# EAGLE design UV_MONITOR_V2_5 (EAGLE 8.4.2)
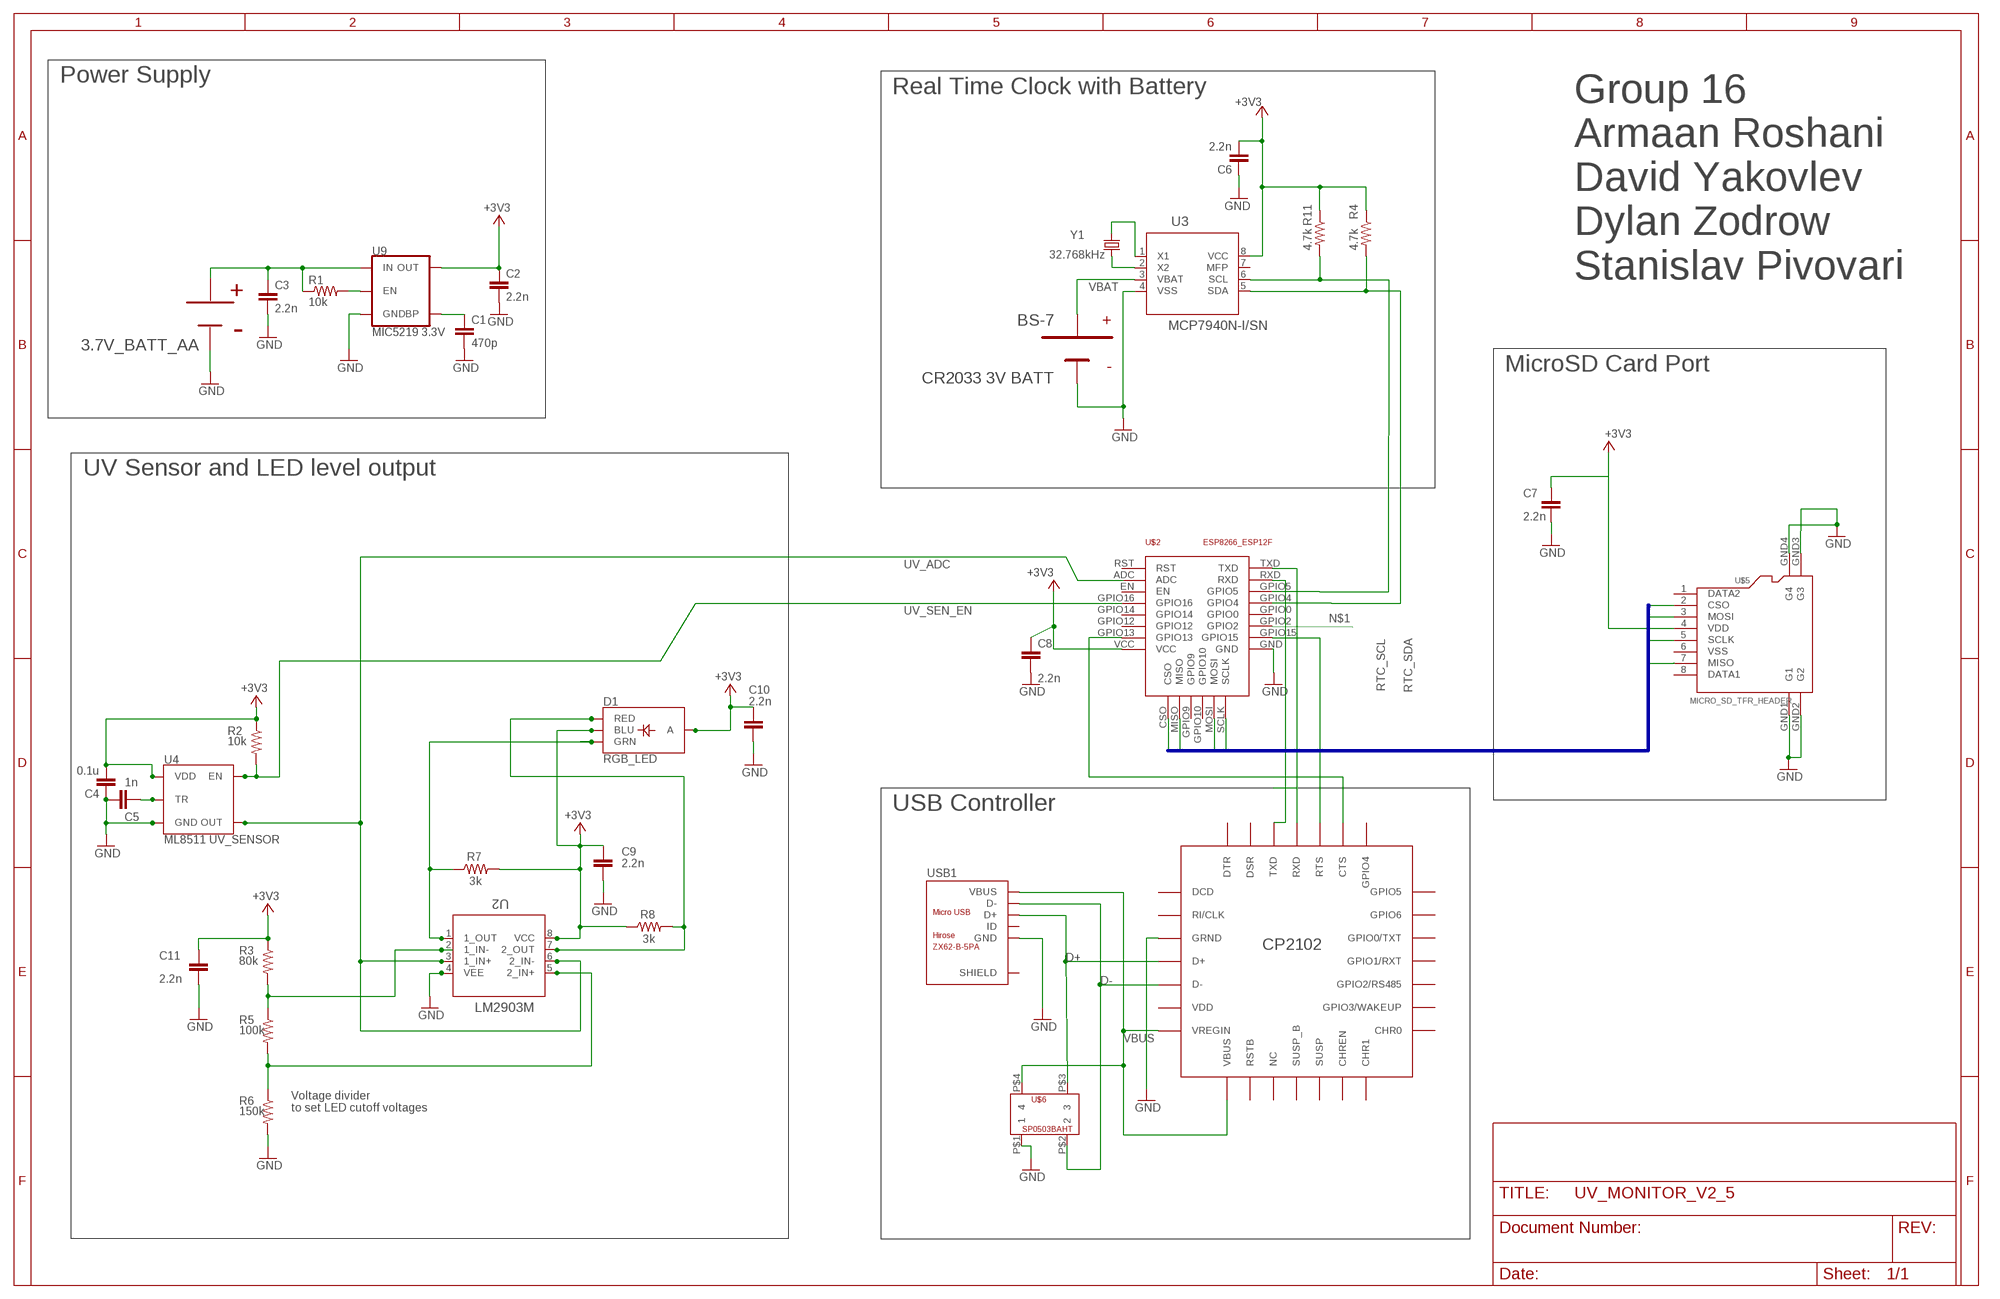
[diagram p0: schematic, sheet 1]

## Parts
C1  470p  C-EUC0805  [C0805]
C2  2.2n  C-EUC0805  [C0805]
C3  2.2n  C-EUC0805  [C0805]
C4  0.1u  C-EUC0805  [C0805]
C5  1n  C-EUC0805  [C0805]
C6  2.2n  C-EUC0805  [C0805]
C7  2.2n  C-EUC0805  [C0805]
C8  2.2n  C-EUC0805  [C0805]
C9  2.2n  C-EUC0805  [C0805]
C10  2.2n  C-EUC0805  [C0805]
C11  2.2n  C-EUC0805  [C0805]
D1  RGB_LED  LED-RGB-CASMD  [LED-TRICOLOR-SMD]
R1  10k  R-US_R0805  [R0805]
R2  10k  R-US_R0805  [R0805]
R3  80k  R-US_R0805  [R0805]
R4  4.7k  R-US_R0805  [R0805]
R5  100k  R-US_R0805  [R0805]
R6  150k  R-US_R0805  [R0805]
R7  3k  R-US_R0805  [R0805]
R8  3k  R-US_R0805  [R0805]
R11  4.7k  R-US_R0805  [R0805]
U2  LM2903M  [M08A]
U3  MCP7940N-I/SN  [SOIC8-N_MC]
U4  ML8511 UV_SENSOR  ML8511  [ML8511]
U9  MIC5219 3.3V  V_REG_MIC52193.3V  [SOT23-5]
U$1  CP2102  [CP2102]
U$2  ESP12F  [ESP12F]
U$3  BK-53  [BK-53]
U$4  BS-7  [BS-7]
U$5  MICRO_SD_TFR_HEADER  [MICRO_SD_TFR_HEADER]
U$6  SP0503BAHT  [SP0503BAHT]
USB1  ZX62-B-5PA  MICRO-USB-SMD(ZX62-B-5PA)  [MICRO-USB5+6P-SMD-0.65-AB]
Y1  32.768kHz  CRYSTAL-32.768KHZSMD-2X6  [CRYSTAL-SMD-2X6-CYL]

## Nets
+3V3: C2.1 C4.2 C6.2 C7.1 C8.1 C9.1 C10.1 C11.1 D1.A D1.B(BLU) R2.1 R3.1 R4.1 R7.2 R8.1 R11.1 U2.8(VCC) U3.8(VCC) U4.7(VDD) U9.5(OUT) U$2.VCC
BP: C1.1 U9.4(BP)
CTS: U$1.CTS U$2.GPIO13
D+: U$1.D+ U$6.P$3 USB1.3(D+)
D-: U$1.D- U$6.P$2 USB1.2(D-)
EN: R1.2 U9.3(EN)
GND: C1.2 C2.2 C3.2 C4.1 C5.2 C6.1 C7.2 C8.2 C9.2 C10.2 C11.2 R6.2 U2.4(VEE) U3.4(VSS) U4.5(GND) U9.2(GND) U$1.GND(GRND) U$1.GRND U$2.GND U$3.GND1 U$3.GND2 U$4.GND U$5.GND1(G1) U$5.GND2(G2) U$5.GND3(G3) U$5.GND4(G4) U$6.P$1 USB1.5(GND)
GREEN_LED: D1.G(GRN) R7.1 U2.1(1_OUT)
H_REF: R3.2 R5.1 U2.2(1_IN-)
L_REF: R5.2 R6.1 U2.5(2_IN+)
MAIN_BAT: C3.1 R1.1 U9.1(IN) U$3.VBAT1(VBAT) U$3.VBAT2(VBAT)
N$1: U$2.GPIO2
N$2: U3.2(X2) Y1.X1
N$3: U$2.SCLK U$5.5(SCLK)
N$4: U$2.MOSI U$5.3(MOSI)
N$5: U$2.MISO U$5.7(MISO)
N$6: U3.1(X1) Y1.X2
N$7: U$2.CSO U$5.2(CSO)
N$8: U$5.4(VDD)
N$9: U$1.RXD U$2.TXD
N$10: U$1.TXD U$2.RXD
RED_LED: D1.R(RED) R8.2 U2.7(2_OUT)
RTC_SCL: R11.2 U3.6(SCL) U$2.GPIO5
RTC_SDA: R4.2 U3.5(SDA) U$2.GPIO4
RTS: U$1.RTS U$2.GPIO15
TR: C5.1 U4.10(TR)
UV_ADC: U2.3(1_IN+) U2.6(2_IN-) U4.8(OUT) U$2.ADC
UV_SEN_EN: R2.2 U4.4(EN) U$2.GPIO16
VBAT: U3.3(VBAT) U$4.VBAT
VBUS: U$1.VBUS U$1.VREGIN U$6.P$4 USB1.1(VBUS)
Unconnected: U3.7(MFP) U$1.CHR0 U$1.CHR1 U$1.CHREN U$1.DCD U$1.DSR U$1.DTR U$1.GPIO0/TXT U$1.GPIO1/RXT U$1.GPIO2/RS485 U$1.GPIO3/WAKEUP U$1.GPIO4 U$1.GPIO5 U$1.GPIO6 U$1.NC U$1.RI/CLK U$1.RSTB U$1.SUSP U$1.SUSPB(SUSP_B) U$1.VDD U$2.EN U$2.GPIO0 U$2.GPIO9 U$2.GPIO10 U$2.GPIO12 U$2.GPIO14 U$2.RST U$5.1(DATA2) U$5.6(VSS) U$5.8(DATA1) USB1.4(ID) USB1.P1(SHIELD) USB1.P2(SHIELD) USB1.P3(SHIELD) USB1.P4(SHIELD) USB1.P5(SHIELD) USB1.P6(SHIELD)

## Buses
B$1

## Notes on the sheet
- Power Supply
- Real Time Clock with Battery
- Group 16
  Armaan Roshani
  David Yakovlev
  Dylan Zodrow
  Stanislav Pivovari
- MicroSD Card Port
- UV Sensor and LED level output
- USB Controller
- Voltage divider
  to set LED cutoff voltages

## Library data of the parts
C1-C11 = rcl:C-EU: CAPACITOR, European symbol; SPICEPREFIX: C
D1 = SparkFun-LED:LED-RGB-CA: LED-RGB Diffused Common Anode Packages: LED RGB-THRU P-LCC-4-3 LED-TRICOLOR-SMD SparkFun Products: RGB Diffused Common Anode- Diffuse <[https://www.sparkfun.com/products/10821]> RGB Diffused Common Anode - Clear <[https://www.sparkfun.com/products/10820]> Qduino Mini <[https://www.sparkfun.com/products/13614]> Triple Output LED RGB - SMD <https://www.sparkfun.com/products/7844>; PROD_ID: DIO-08324
R1-R8 R11 = rcl:R-US_: RESISTOR, American symbol; SPICEPREFIX: R
U2 = LM2903M:LM2903M; MANUFACTURER_PART_NUMBER: LM2903M; VENDOR: Texas Instruments
U3 = MCP7940N:MCP7940N-I/SN; MANUFACTURER_PART_NUMBER: MCP7940NISN; VENDOR: MICROCHIP
U4 = SparkFun-Sensors:ML8511: Lapis ML8511 Ultraviolet Sensor The MP8511 UV (ultraviolet) Sensor works by outputing an analog signal in relation to the amount of UV light that’s detected. This sensor detects 280-390nm light most effectively. This is categorized as part of the UVB (burning rays) spectrum and most of the UVA (tanning rays) spectrum. It outputs a analog voltage that is linearly related to the measured UV intensity (mW/cm2). Datasheet <https://cdn.sparkfun.com/datasheets/Sensors/LightImaging/ML8511_3-8-13.pdf> SparkFun Products SparkFun UV Sensor Breakout - ML8511 <https://www.sparkfun.com/products/12705> (SEN-12705); PROD_ID: IC-11927
U9 = SparkFun-IC-Power:V_REG_MIC5219: V_REG MIC5219 Standard 3.3V and 5V 500mA LDO voltage regulator in SOT-23 layout. Micrel part MIC5219. BP (by-pass) pin is used to lower output noise with 470pF cap, may be left open.; PROD_ID: VREG-09872
U$1 = CP2102:CP2102
U$2 = ESP8266-ESP12F:ESP12F
U$3 = BK-53:BK-53
U$4 = BS-7:BS-7
U$5 = MicroSD TFR Header:MICRO_SD_TFR_HEADER
U$6 = SP0503BAHT:SP0503BAHT
USB1 = Seeed-Connector:MICRO-USB-SMD(ZX62-B-5PA): 320010005; MPN: ZX62-B-5PA
Y1 = SparkFun-Clocks:CRYSTAL-32.768KHZ: 32.768kHz Crystal Frequency: 32.768kHz Frequency Stability: ±20ppm Load Capacitance: 12.5pF (PTH-2X6 & SMD-3.2X1.5), 6pF (SMD-2X6) SparkFun Products: SparkFun BigTime Watch Kit <https://www.sparkfun.com/products/11734> SparkFun nRF52832 Breakout <https://www.sparkfun.com/products/13990> SparkFun Real Time Clock Module <https://www.sparkfun.com/products/12708>; PROD_ID: XTAL-07894

## Net classes
0 default: clearance 0.205 mm

## Board
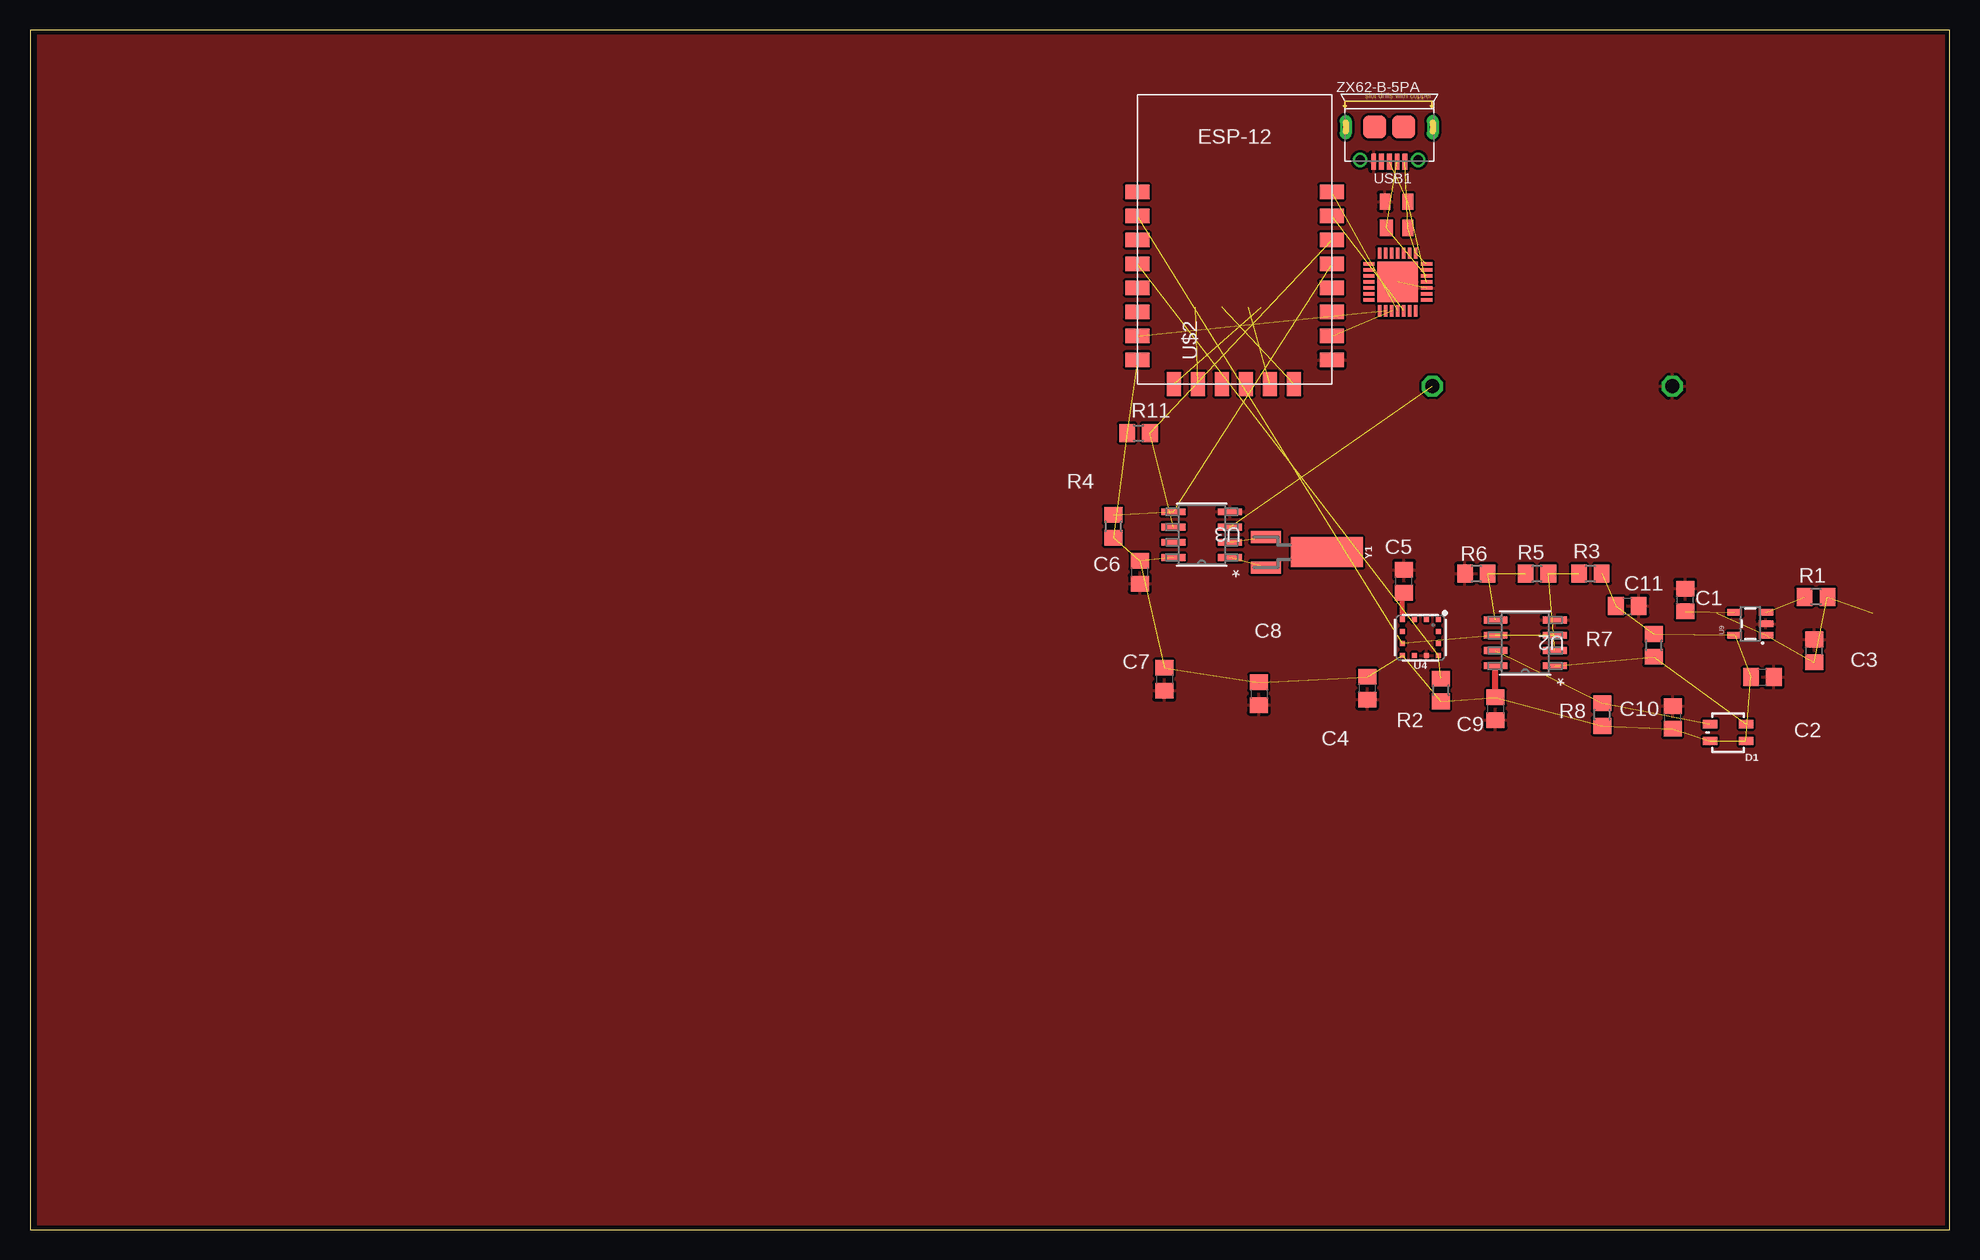
[diagram p1: board, top side]
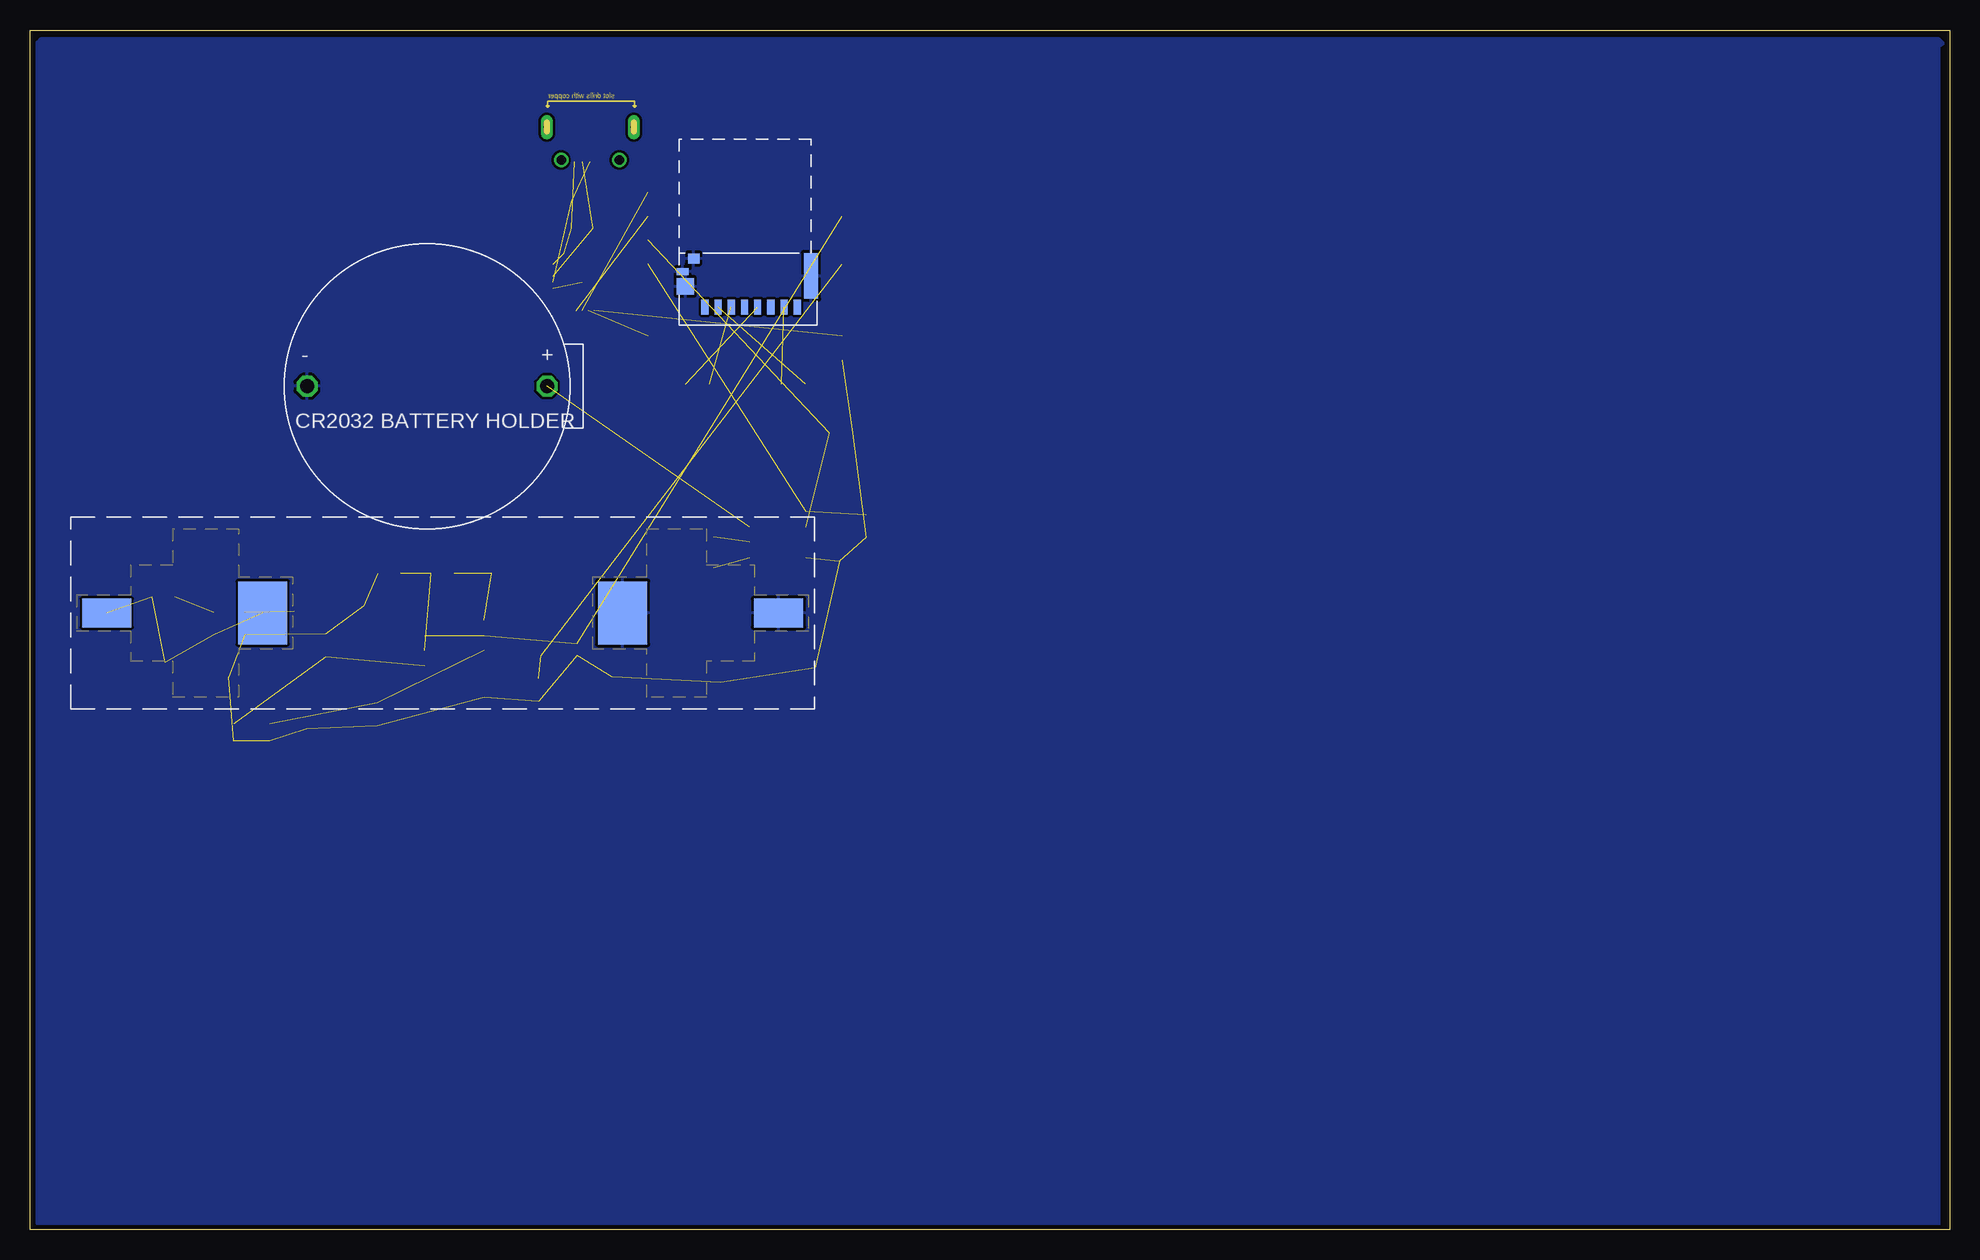
[diagram p2: board, bottom side, seen from below]

Size 160 x 100 mm. Coordinates in mm from the lower left corner, seen from the top.
Outline: 0,0 160,0 160,100 0,100 0,0
Copper layers (1*16): Top 0.0356mm / dielectric 1.5011mm / Bottom 0.0356mm
Design rules "osh-park-2-layers-design-rules": minimum track width 6mil, minimum drill 10mil, track to track 6mil, track to pad 6mil, pad to pad 6mil, via to via 6mil, smd to smd 6mil, copper to edge 15mil, drill to drill 6mil, minimum pad ring 7mil, minimum via ring 7mil, stop-mask expansion 3mil, vias tented up to drill 0mil, thermal gap 10mil

### Footprints (pad centres in the part's own frame; a part is rotated, then mirrored left to right if it is on the bottom)
C0805 = smd 1.3 x 1.5: 1 -0.95,0; 2 0.95,0
LED-TRICOLOR-SMD = smd 1.2 x 0.7: A 1.5,0.7; B -1.5,0.7; G -1.5,-0.7; R 1.5,-0.7
R0805 = smd 1.3 x 1.5: 1 -0.95,0; 2 0.95,0
M08A = smd 1.981 x 0.559: 1 -2.464,1.905; 2 -2.464,0.635; 3 -2.464,-0.635; 4 -2.464,-1.905; 5 2.464,-1.905; 6 2.464,-0.635; 7 2.464,0.635; 8 2.464,1.905
SOIC8-N_MC = smd 1.981 x 0.559: 1 -2.362,1.905; 2 -2.362,0.635; 3 -2.362,-0.635; 4 -2.362,-1.905; 5 2.362,-1.905; 6 2.362,-0.635; 7 2.362,0.635; 8 2.362,1.905
ML8511 = smd 0.4 x 0.4: 1 -1.5,-1.5; 2 -1.5,-0.5; 3 -1.5,0.5; 4 -1.5,1.5; 5 -0.5,1.5; 6 0.5,1.5; 7 1.5,1.5; 8 1.5,0.5; 9 1.5,-0.5; 10 1.5,-1.5; 11 0.5,-1.5; 12 -0.5,-1.5
SOT23-5 = smd 0.55 x 1.2: 1 -0.95,-1.3; 2 0,-1.3; 3 0.95,-1.3; 4 0.95,1.3; 5 -0.95,1.3
CP2102 = smd 0.95 x 0.3: CHR0 2.4,-1.5; D+ -2.4,0; D- -2.4,-0.5; DCD -2.4,1.5; GPIO0/TXT 2.4,0.5; GPIO1/RXT 2.4,0; GPIO2/RS485 2.4,-0.5; GPIO3/WAKEUP 2.4,-1; GPIO5 2.4,1.5; GPIO6 2.4,1; GRND -2.4,0.5; RI/CLK -2.4,1; VDD -2.4,-1; VREGIN -2.4,-1.5 | smd 0.3 x 0.95: CHR1 1.5,-2.4; CHREN 1,-2.4; CTS 1,2.4; DSR -1,2.4; DTR -1.5,2.4; GPIO4 1.5,2.4; NC -0.5,-2.4; RSTB -1,-2.4; RTS 0.5,2.4; RXD 0,2.4; SUSP 0.5,-2.4; SUSPB 0,-2.4; TXD -0.5,2.4; VBUS -1.5,-2.4 | smd 3.35 x 3.35: GND 0,0
ESP12F = smd 2 x 1.2: ADC 0,14; EN 0,12; GND 16.2,2; GPIO0 16.2,8; GPIO2 16.2,6; GPIO4 16.2,10; GPIO5 16.2,12; GPIO12 0,6; GPIO13 0,4; GPIO14 0,8; GPIO15 16.2,4; GPIO16 0,10; RST 0,16; RXD 16.2,14; TXD 16.2,16; VCC 0,2 | smd 1.2 x 2: CSO 3.05,0; GPIO9 7.05,0; GPIO10 9.05,0; MISO 5.05,0; MOSI 11.05,0; SCLK 13.05,0
BK-53 = smd 5.25 x 4.1: GND1 0,-15; VBAT1 0,15 | smd 2.4 x 4.1: GND2 0,-28; VBAT2 0,28
BS-7 = drill 1.17 octagon: GND -10,0; VBAT 10,0
MICRO_SD_TFR_HEADER = smd 0.6 x 1.25: 1 3.85,2; 2 2.75,2; 3 1.65,2; 4 0.55,2; 5 -0.55,2; 6 -1.65,2; 7 -2.75,2; 8 -3.85,2 | smd 1.2 x 3.8: GND1 -5,-0.6 | smd 1.45 x 1.4: GND2 5.475,0.275 | smd 1 x 0.6: GND3 5.7,-0.95 | smd 0.95 x 0.85: GND4 4.775,-2.05
SP0503BAHT = smd 0.9 x 1.35: P$1 -0.95,1.1; P$3 0.95,1.1; P$4 0.95,-1.1 | smd 1.1 x 1.35: P$2 -0.85,-1.1
MICRO-USB5+6P-SMD-0.65-AB = smd 0.4 x 1.35: 1 -1.3,2.875; 2 -0.65,2.875; 3 0,2.875; 4 0.65,2.875; 5 1.3,2.875 | smd 1.9 x 1.9: P1 -1.2,0; P2 1.2,0 | drill 0.508 pad 1.016 long: P3 -3.625,0; P4 3.625,0 | drill 0.8: P5 -2.425,2.73; P6 2.425,2.73
CRYSTAL-SMD-2X6-CYL = smd 2.5 x 6: SHEILD 0,5.08 | smd 1 x 2.5: X1 -1.27,0; X2 1.27,0

### Placement (x,y rotation side)
C1  137.97,52.48 90 top
C2  144.4,46.05 0 top
C3  148.72,48.24 90 top
C4  111.47,45.13 90 top
C5  114.53,54.05 90 top
C6  92.51,54.79 90 top
C7  94.55,45.87 270 top
C8  102.43,44.67 270 top
C9  122.15,43.42 270 top
C10  136.93,42.69 90 top
C11  133.14,51.98 0 top
D1  141.54,41.43 180 top
R1  148.87,52.75 180 top
R2  117.6,44.97 90 top
R3  130.06,54.67 180 top
R4  90.31,58.63 90 top
R5  125.61,54.67 180 top
R6  120.56,54.67 180 top
R7  135.35,48.7 90 top
R8  131.05,42.93 90 top
R11  92.4,66.4 0 top
U2  124.63,48.9 180 top
U3  97.67,57.93 180 top
U4  115.9,49.35 180 top
U9  143.4,50.5 90 top
U$1  114,79 180 top
U$2  92.3,70.5 0 top
U$3  125.6,51.4 90 bottom
U$4  126.9,70.3 0 bottom
U$5  99.9,78.9 180 bottom
U$6  113.9,84.6 0 top
USB1  113.3,91.9 180 top
Y1  103.02,56.46 270 top

### Tracks (layer width: path | path; a pad name or v marks a point on that pad's centre or on a via)
+3V3  (19 unrouted)
  Top 0.508: C9.1 122.17,44.39 U2.8
BP  (1 unrouted)
CTS  (1 unrouted)
D+  (2 unrouted)
D-  (2 unrouted)
EN  (1 unrouted)
GND  (1 unrouted)
  pour Bottom: 0.9,98.6 0.9,0.4 1,0.3 159.2,0.3 159.4,0.5 159.4,99 159.1,99.3 0.9,99.3 0.5,98.9
  pour Top: 0.7,99.5 0.7,0.2 0.5,0 159.1,0 159.8,0.7 159.8,99.4 159.6,99.6 0.5,99.6
GREEN_LED  (2 unrouted)
H_REF  (2 unrouted)
L_REF  (2 unrouted)
MAIN_BAT  (4 unrouted)
N$2  (1 unrouted)
N$3  (1 unrouted)
N$4  (1 unrouted)
N$5  (1 unrouted)
N$6  (1 unrouted)
N$7  (1 unrouted)
N$9  (1 unrouted)
N$10  (1 unrouted)
RED_LED  (2 unrouted)
RTC_SCL  (2 unrouted)
RTC_SDA  (2 unrouted)
RTS  (1 unrouted)
TR
  Top 0.406: U4.10 114.4,52.97 C5.1
UV_ADC  (3 unrouted)
UV_SEN_EN  (2 unrouted)
VBAT  (1 unrouted)
VBUS  (3 unrouted)